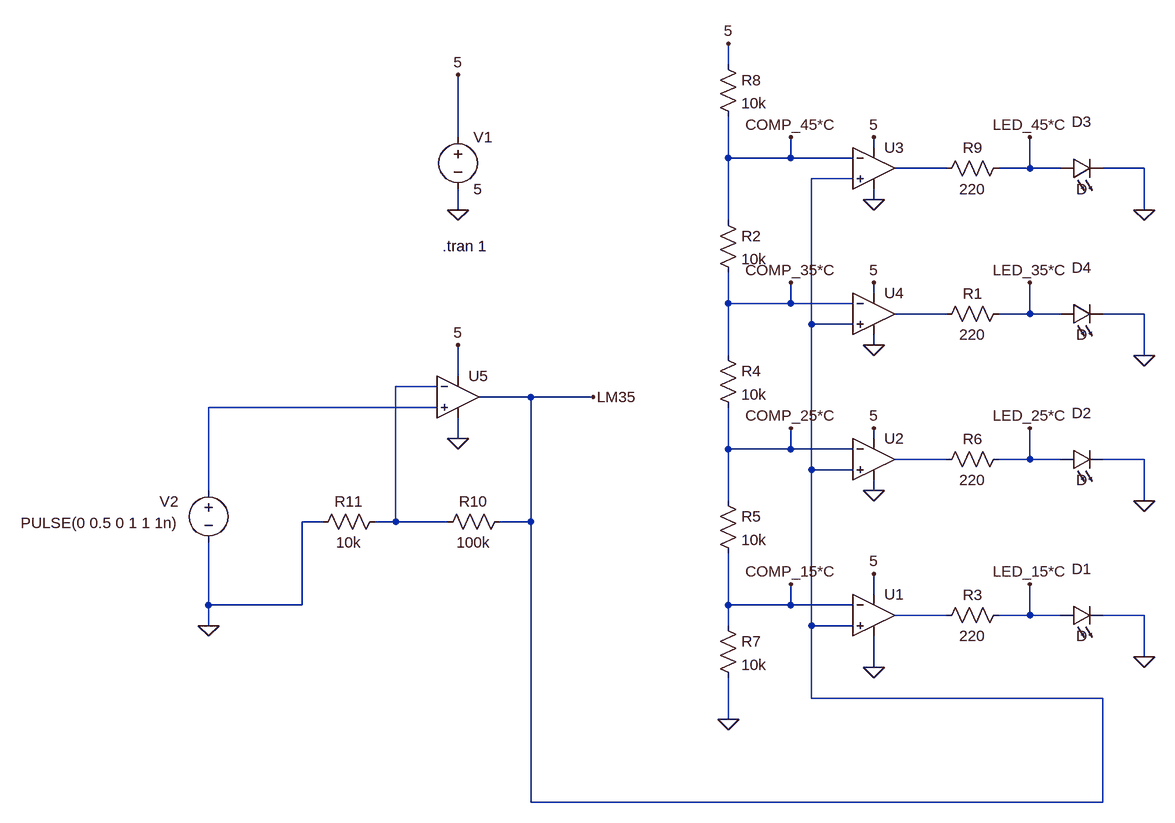
[diagram p0: schematic thermometerSim.asc]
thermometerSim.asc, the LTspice schematic file:
Version 4.1
SHEET 1 880 788
WIRE 128 -848 128 -880
WIRE -288 -736 -288 -832
WIRE 352 -720 352 -736
WIRE 128 -704 128 -768
WIRE 224 -704 224 -736
WIRE 224 -704 128 -704
WIRE 320 -704 224 -704
WIRE 464 -688 384 -688
WIRE 592 -688 592 -736
WIRE 592 -688 544 -688
WIRE 640 -688 592 -688
WIRE 768 -688 704 -688
WIRE 320 -672 256 -672
WIRE 352 -640 352 -656
WIRE -288 -624 -288 -656
WIRE 768 -624 768 -688
WIRE 128 -608 128 -704
WIRE 352 -496 352 -512
WIRE 128 -480 128 -528
WIRE 224 -480 224 -512
WIRE 224 -480 128 -480
WIRE 320 -480 224 -480
WIRE 464 -464 384 -464
WIRE 592 -464 592 -512
WIRE 592 -464 544 -464
WIRE 640 -464 592 -464
WIRE 768 -464 704 -464
WIRE 256 -448 256 -672
WIRE 320 -448 256 -448
WIRE 352 -416 352 -432
WIRE 128 -400 128 -480
WIRE 768 -400 768 -464
WIRE -288 -368 -288 -416
WIRE -320 -352 -384 -352
WIRE -176 -336 -256 -336
WIRE -80 -336 -176 -336
WIRE -320 -320 -672 -320
WIRE -288 -272 -288 -304
WIRE 352 -272 352 -288
WIRE 128 -256 128 -320
WIRE 224 -256 224 -288
WIRE 224 -256 128 -256
WIRE 320 -256 224 -256
WIRE 464 -240 384 -240
WIRE 592 -240 592 -288
WIRE 592 -240 544 -240
WIRE 640 -240 592 -240
WIRE 768 -240 704 -240
WIRE 256 -224 256 -448
WIRE 320 -224 256 -224
WIRE -672 -192 -672 -320
WIRE 352 -192 352 -208
WIRE 128 -176 128 -256
WIRE 768 -176 768 -240
WIRE -496 -144 -528 -144
WIRE -384 -144 -384 -352
WIRE -384 -144 -416 -144
WIRE -304 -144 -384 -144
WIRE -176 -144 -176 -336
WIRE -176 -144 -224 -144
WIRE 352 -32 352 -64
WIRE -672 -16 -672 -112
WIRE -528 -16 -528 -144
WIRE -528 -16 -672 -16
WIRE 128 -16 128 -96
WIRE 224 -16 224 -48
WIRE 224 -16 128 -16
WIRE 320 -16 224 -16
WIRE 464 0 384 0
WIRE 592 0 592 -48
WIRE 592 0 544 0
WIRE 640 0 592 0
WIRE 768 0 704 0
WIRE -672 16 -672 -16
WIRE 128 16 128 -16
WIRE 256 16 256 -224
WIRE 320 16 256 16
WIRE 768 64 768 0
WIRE 352 80 352 32
WIRE 256 128 256 16
WIRE 704 128 256 128
WIRE 128 160 128 96
WIRE -176 288 -176 -144
WIRE 704 288 704 128
WIRE 704 288 -176 288
FLAG -288 -624 0
FLAG -288 -832 5
FLAG 352 -64 5
FLAG 352 80 0
FLAG -672 16 0
FLAG 768 64 0
FLAG 352 -288 5
FLAG 352 -192 0
FLAG 768 -176 0
FLAG 352 -736 5
FLAG 352 -640 0
FLAG 768 -624 0
FLAG 128 160 0
FLAG 128 -880 5
FLAG 352 -512 5
FLAG 352 -416 0
FLAG 768 -400 0
FLAG -288 -272 0
FLAG -288 -416 5
FLAG -80 -336 LM35
FLAG 592 -48 LED_15*C
FLAG 592 -288 LED_25*C
FLAG 592 -512 LED_35*C
FLAG 592 -736 LED_45*C
FLAG 224 -736 COMP_45*C
FLAG 224 -512 COMP_35*C
FLAG 224 -288 COMP_25*C
FLAG 224 -48 COMP_15*C
SYMBOL voltage -288 -752 R0
WINDOW 123 0 0 Left 0
WINDOW 39 0 0 Left 0
SYMATTR InstName V1
SYMATTR Value 5
SYMBOL OpAmps\\UniversalOpAmp2 352 0 R0
SYMATTR InstName U1
SYMBOL voltage -672 -208 R0
WINDOW 123 0 0 Left 0
WINDOW 39 0 0 Left 0
WINDOW 3 -289 66 Left 2
WINDOW 0 -75 33 Left 2
SYMATTR Value PULSE(0 0.5 0 1 1 1n)
SYMATTR InstName V2
SYMBOL LED 640 16 R270
WINDOW 0 72 32 VTop 2
WINDOW 3 0 32 VBottom 2
SYMATTR InstName D1
SYMBOL res 560 -16 R90
WINDOW 0 0 56 VBottom 2
WINDOW 3 32 56 VTop 2
SYMATTR InstName R3
SYMATTR Value 220
SYMBOL OpAmps\\UniversalOpAmp2 352 -240 R0
SYMATTR InstName U2
SYMBOL LED 640 -224 R270
WINDOW 0 72 32 VTop 2
WINDOW 3 0 32 VBottom 2
SYMATTR InstName D2
SYMBOL res 560 -256 R90
WINDOW 0 0 56 VBottom 2
WINDOW 3 32 56 VTop 2
SYMATTR InstName R6
SYMATTR Value 220
SYMBOL OpAmps\\UniversalOpAmp2 352 -688 R0
SYMATTR InstName U3
SYMBOL LED 640 -672 R270
WINDOW 0 72 32 VTop 2
WINDOW 3 0 32 VBottom 2
SYMATTR InstName D3
SYMBOL res 560 -704 R90
WINDOW 0 0 56 VBottom 2
WINDOW 3 32 56 VTop 2
SYMATTR InstName R9
SYMATTR Value 220
SYMBOL OpAmps\\UniversalOpAmp2 352 -464 R0
SYMATTR InstName U4
SYMBOL LED 640 -448 R270
WINDOW 0 72 32 VTop 2
WINDOW 3 0 32 VBottom 2
SYMATTR InstName D4
SYMBOL res 560 -480 R90
WINDOW 0 0 56 VBottom 2
WINDOW 3 32 56 VTop 2
SYMATTR InstName R1
SYMATTR Value 220
SYMBOL res 112 -624 R0
SYMATTR InstName R2
SYMATTR Value 10k
SYMBOL res 112 -416 R0
SYMATTR InstName R4
SYMATTR Value 10k
SYMBOL res 112 -192 R0
SYMATTR InstName R5
SYMATTR Value 10k
SYMBOL res 112 0 R0
SYMATTR InstName R7
SYMATTR Value 10k
SYMBOL res 112 -864 R0
SYMATTR InstName R8
SYMATTR Value 10k
SYMBOL OpAmps\\UniversalOpAmp -288 -336 R0
SYMATTR InstName U5
SYMBOL res -208 -160 R90
WINDOW 0 0 56 VBottom 2
WINDOW 3 32 56 VTop 2
SYMATTR InstName R10
SYMATTR Value 100k
SYMBOL res -400 -160 R90
WINDOW 0 0 56 VBottom 2
WINDOW 3 32 56 VTop 2
SYMATTR InstName R11
SYMATTR Value 10k
TEXT -312 -568 Left 2 !.tran 1

The netlist it stands for:
* thermometerSim.asc
V1 5 0 5
X§U1 LM35 COMP_15*C 5 0 N006 level2 Avol=1Meg GBW=10Meg Slew=10Meg Ilimit=25m Rail=0 Vos=0 En=0 Enk=0 In=0 Ink=0 Rin=500Meg  ; pins In+ In- V+ V- OUT
V2 N004 0 PULSE(0 0.5 0 1 1 1n)
D1 LED_15*C 0 D
R3 LED_15*C N006 220
X§U2 LM35 COMP_25*C 5 0 N005 level2 Avol=1Meg GBW=10Meg Slew=10Meg Ilimit=25m Rail=0 Vos=0 En=0 Enk=0 In=0 Ink=0 Rin=500Meg  ; pins In+ In- V+ V- OUT
D2 LED_25*C 0 D
R6 LED_25*C N005 220
X§U3 LM35 COMP_45*C 5 0 N001 level2 Avol=1Meg GBW=10Meg Slew=10Meg Ilimit=25m Rail=0 Vos=0 En=0 Enk=0 In=0 Ink=0 Rin=500Meg  ; pins In+ In- V+ V- OUT
D3 LED_45*C 0 D
R9 LED_45*C N001 220
X§U4 LM35 COMP_35*C 5 0 N002 level2 Avol=1Meg GBW=10Meg Slew=10Meg Ilimit=25m Rail=0 Vos=0 En=0 Enk=0 In=0 Ink=0 Rin=500Meg  ; pins In+ In- V+ V- OUT
D4 LED_35*C 0 D
R1 LED_35*C N002 220
R2 COMP_45*C COMP_35*C 10k
R4 COMP_35*C COMP_25*C 10k
R5 COMP_25*C COMP_15*C 10k
R7 COMP_15*C 0 10k
R8 5 COMP_45*C 10k
X§U5 N004 N003 5 0 LM35 level1 Avol=1Meg GBW=10Meg Vos=0 En=0 Enk=0 In=0 Ink=0 Rin=500Meg  ; pins In+ In- V+ V- OUT
R10 LM35 N003 100k
R11 N003 0 10k
.model D D
.lib standard.dio
.tran 1
.lib UniversalOpAmp2.lib
.lib UniversalOpAmp1.lib
.backanno
.end